# Altium project PCB_Project_RGB_Team--B2.PrjPcb
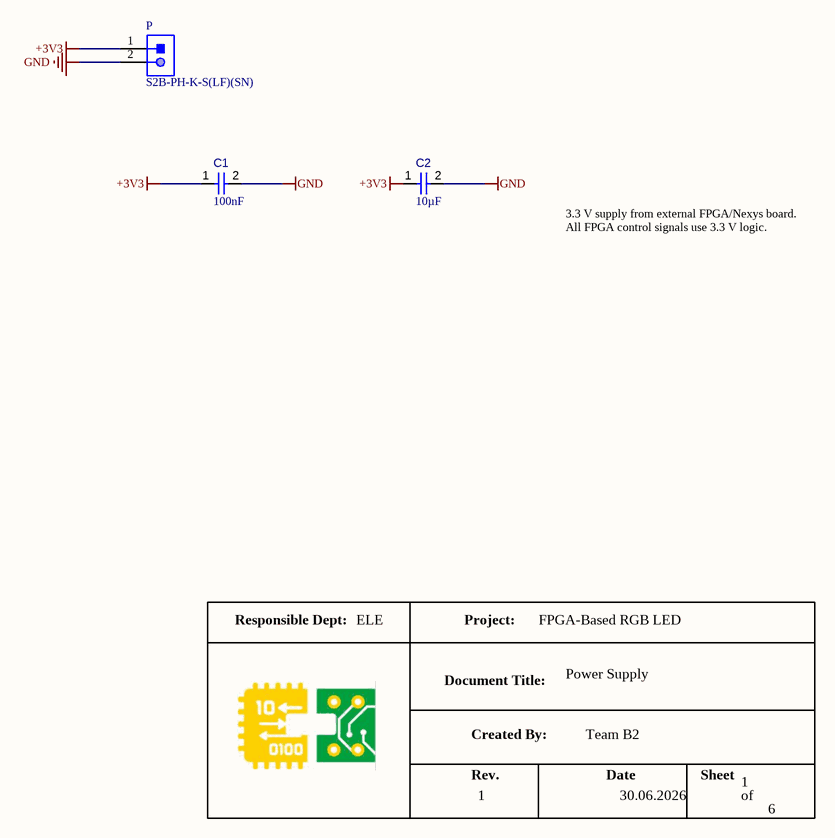
[diagram p0: 01_Power.SchDoc]
6 sheets, 35 parts. Net scope: global (net labels, ports and power ports of the same name join across sheets).
Board file: PCB.PcbDoc
Sheets:
  01_Power.SchDoc
  02_FPGA_Interface.SchDoc
  03_Mode_Inputs.SchDoc
  04_RGB_LED_Driver.SchDoc
  05_Testpoints_Output.SchDoc
  06_Clock_Configuration.SchDoc

## Sheet 01_Power.SchDoc
size A; SheetNumber: 1; SheetTotal: 6

### Parts
C1  value 100nF  [CAPC2013X95X50LL10T25]  (hidden comment: Capacitor 100 nF +/-10% 50 V 0805)
C2  value 10µF  [CAPC0805(2012)145_L]  (hidden comment: Capacitor 10µF +/-20% 25V 0805)
P  S2B-PH-K-S(LF)(SN)  [JST-S2B-PH-K-S_V]

### Nets
+3V3: C1.1 C2.1 P.1  [project net  +3V3]
GND: C1.2 C2.2 P.2

### Notes on the sheet
- 3.3 V supply from external FPGA/Nexys board.
  All FPGA control signals use 3.3 V logic.
- Responsible Dept:
- ELE
- Project:
- FPGA-Based RGB LED
- Document Title:
- Created By:
- Power Supply
- Team B2
- Rev.
- 1
- Date
- 30.06.2026
- Sheet
- of
- 6

### Library data of the parts
C1 = CMP-001-00018-6: Chip Capacitor, 100 nF, +/- 10%, 50 V, 0805 (2012 Metric); Capacitor Type: Ceramic; Voltage Rating: 50V; Pins: 2; Max Operating Temperature: 125°C; Min Operating Temperature: -55°C; Mounting Technology: SM; Case/Package: 0805; RoHS Compliant: True; Tolerance: 10%
C2 = CMP-001-00079-4: Chip Capacitor, 10µF +/-20%, 25V, 0805, Thickness 1.45 mm; Tolerance: 10%; Max Operating Temperature: 85°C; Case/Package: 0805; Voltage Rating: 25V; Min Operating Temperature: -55°C; Mounting Technology: SMT; Pins: 2
P = CMP-1755-00004-1: Male Header, Pitch 2 mm, 1 x 2 Position, Height 4.8 mm, Tail Length 3.4 mm, -25 to 85 degC, RoHS, Bulk; Case\Package: Radial; Tolerance: 20%; Capacitance: 10 uF; Voltage Rating (DC): 50 V; Packaging: Bulk; ComponentLink1URL: http://www.jst-mfg.com/product/pdf/eng/ePH.pdf; Radiation Hardening: No; Height: 11 mm; Package Quantity: 200; PackageDescription: Male Header, Pitch 2 mm, 1 x 2 Position, Height 4.8 mm, Tail Length 3.4 mm; PackageReference: S2B-PH-K-S; Diameter: 5 mm; Pins: 2; Mount: Through Hole; Max Operating Temperature: 85 degC; Min Operating Temperature: -40 degC; ComponentLink1Description: Datasheet; DatasheetVersion: Dec-12; Length: 11 mm; Lead Pitch: 2 mm; REACH SVHC: No SVHC; Voltage Rating: 50 V; RoHSCompliant: true

## Sheet 02_FPGA_Interface.SchDoc
size A; SheetNumber: 2; SheetTotal: 6
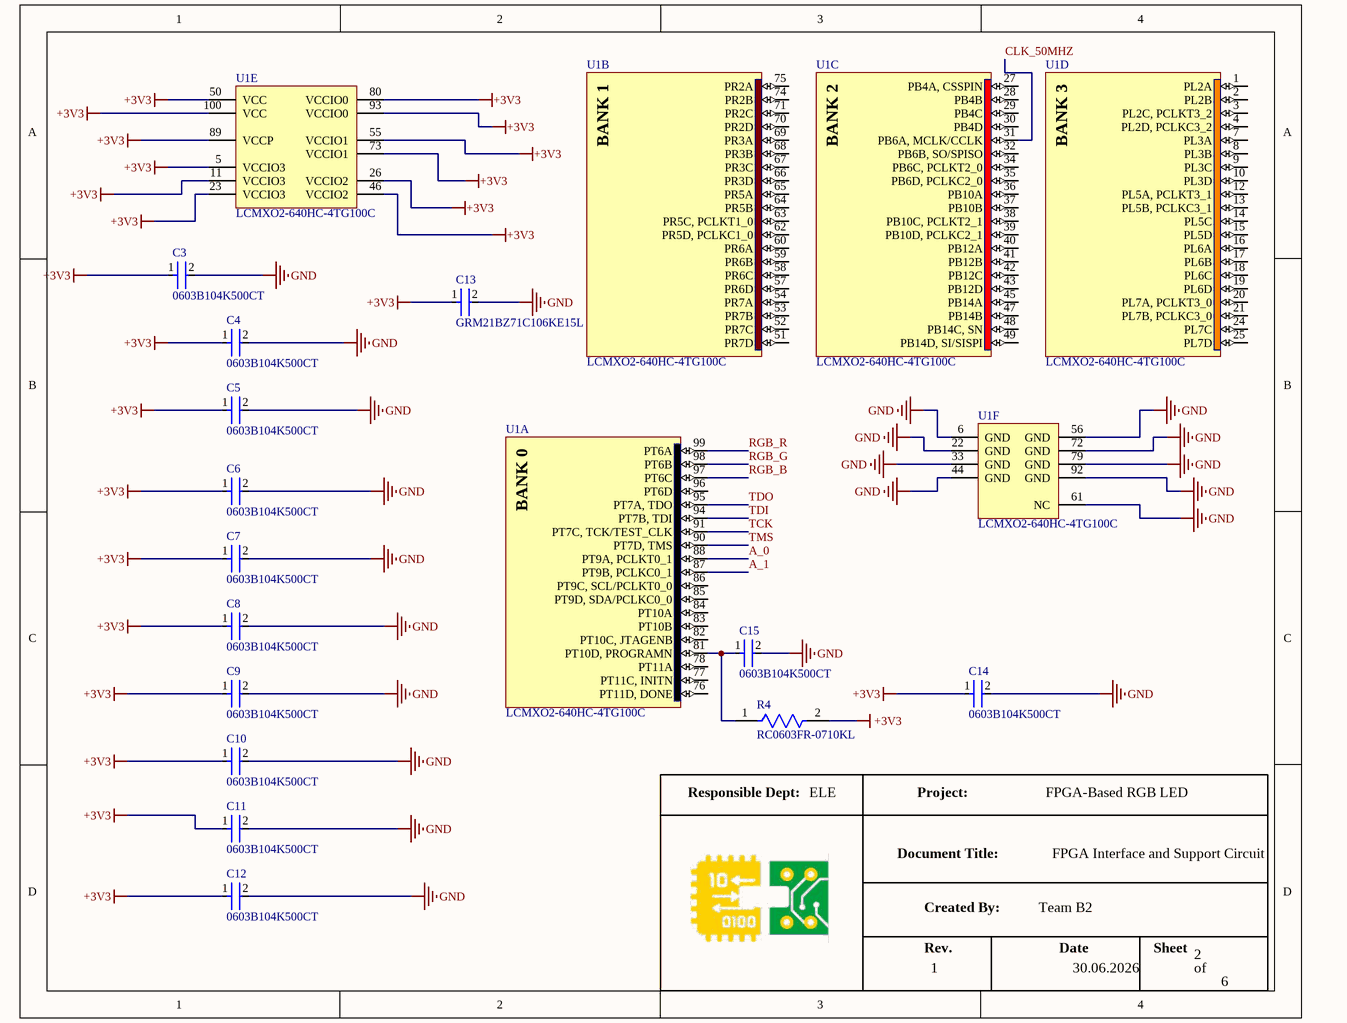
[diagram p1: 02_FPGA_Interface.SchDoc]

### Parts
C3  0603B104K500CT  [FP-0603B104K500CT-IPC_C]
C4  0603B104K500CT  [FP-0603B104K500CT-IPC_C]
C5  0603B104K500CT  [FP-0603B104K500CT-IPC_C]
C6  0603B104K500CT  [FP-0603B104K500CT-IPC_C]
C7  0603B104K500CT  [FP-0603B104K500CT-IPC_C]
C8  0603B104K500CT  [FP-0603B104K500CT-IPC_C]
C9  0603B104K500CT  [FP-0603B104K500CT-IPC_C]
C10  0603B104K500CT  [FP-0603B104K500CT-IPC_C]
C11  0603B104K500CT  [FP-0603B104K500CT-IPC_C]
C12  0603B104K500CT  [FP-0603B104K500CT-IPC_C]
C13  GRM21BZ71C106KE15L  [FP-GRM21B-0_2-e0_2_0_7-IPC_C]
C14  0603B104K500CT  [FP-0603B104K500CT-IPC_C]
C15  0603B104K500CT  [FP-0603B104K500CT-IPC_C]
R4  RC0603FR-0710KL  [FP-RC0603-0_55-IPC_C]
U1  LCMXO2-640HC-4TG100C  [TQFP100_M]  (parts A,B,C,D,E,F of 6)

### Nets
 +3V3: C3.1 C4.1 C5.1 C6.1 C7.1 C8.1 C9.1 C10.1 C11.1 C12.1 C13.1 C14.1 R4.2 U1.5(VCCIO3) U1.11(VCCIO3) U1.23(VCCIO3) U1.26(VCCIO2) U1.46(VCCIO2) U1.50(VCC) U1.55(VCCIO1) U1.73(VCCIO1) U1.80(VCCIO0) U1.89(VCCP) U1.93(VCCIO0) U1.100(VCC)  [also labelled +3V3]
GND: C3.2 C4.2 C5.2 C6.2 C7.2 C8.2 C9.2 C10.2 C11.2 C12.2 C13.2 C14.2 C15.2 U1.6(GND) U1.22(GND) U1.33(GND) U1.44(GND) U1.56(GND) U1.61(NC) U1.72(GND) U1.79(GND) U1.92(GND)
A_0: U1.88(PT9A,_PCLKT0_1)
A_1: U1.87(PT9B,_PCLKC0_1)
CLK_50MHZ: U1.31(PB6A,_MCLK/CCLK)
RGB_B: U1.97(PT6C)
RGB_G: U1.98(PT6B)
RGB_R: U1.99(PT6A)
TCK: U1.91(PT7C,_TCK/TEST_CLK)
TDI: U1.94(PT7B,_TDI)
TDO: U1.95(PT7A,_TDO)
TMS: U1.90(PT7D,_TMS)
NetC15_1: C15.1 R4.1 U1.81(PT10D,_PROGRAMN)

Not connected (* = marked no-connect by the designer): U1 1(PL2A) 2(PL2B) 3(PL2C,_PCLKT3_2) 4(PL2D,_PCLKC3_2) 7(PL3A) 8(PL3B) 9(PL3C) 10(PL3D) 12(PL5A,_PCLKT3_1) 13(PL5B,_PCLKC3_1) 14(PL5C) 15(PL5D) 16(PL6A) 17(PL6B) 18(PL6C) 19(PL6D) 20(PL7A,_PCLKT3_0) 21(PL7B,_PCLKC3_0) 24(PL7C) 25(PL7D) 27(PB4A,_CSSPIN) 28(PB4B) 29(PB4C) 30(PB4D) 32(PB6B,_SO/SPISO) 34(PB6C,_PCLKT2_0) 35(PB6D,_PCLKC2_0) 36(PB10A) 37(PB10B) 38(PB10C,_PCLKT2_1) 39(PB10D,_PCLKC2_1) 40(PB12A) 41(PB12B) 42(PB12C) 43(PB12D) 45(PB14A) 47(PB14B) 48(PB14C,_SN) 49(PB14D,_SI/SISPI) 51(PR7D) 52(PR7C) 53(PR7B) 54(PR7A) 57(PR6D) 58(PR6C) 59(PR6B) 60(PR6A) 62(PR5D,_PCLKC1_0) 63(PR5C,_PCLKT1_0) 64(PR5B) 65(PR5A) 66(PR3D) 67(PR3C) 68(PR3B) 69(PR3A) 70(PR2D) 71(PR2C) 74(PR2B) 75(PR2A) 76(PT11D,_DONE) 77(PT11C,_INITN) 78(PT11A) 82(PT10C,_JTAGENB) 83(PT10B) 84(PT10A) 85(PT9D,_SDA/PCLKC0_0) 86(PT9C,_SCL/PCLKT0_0) 96(PT6D)

### Notes on the sheet
- Responsible Dept:
- ELE
- Project:
- FPGA-Based RGB LED
- Document Title:
- Created By:
- Team B2
- FPGA Interface and Support Circuit
- Rev.
- 1
- Date
- 30.06.2026
- Sheet
- of
- 2
- 6
- (in symbol CMP-0111-00271-1, part A) BANK 0
- (in symbol CMP-0111-00271-1, part B) BANK 1
- (in symbol CMP-0111-00271-1, part C) BANK 2
- (in symbol CMP-0111-00271-1, part D) BANK 3

### Library data of the parts
C3-C12 C14 C15 = CMP-45632-000007-1: CAP CER 0.1UF 50V X7R 0603; Tolerance: 10%; Capacitance: 100nF; Radiation Hardening: No; Depth: 0.8mm; Length: 1.6mm; Voltage Rating: 50V; Dielectric: X7R; Case/Package: 0603; RoHS Compliant: Yes; Case Code (Metric): 1608; Voltage Rating (DC): 50V; Min Operating Temperature: -55°C; Series: -; Max Operating Temperature: 125°C; Lead Free: Lead Free; Case Code (Imperial): 0603; Packaging: Tape and Reel
C13 = CMP-06035-007712-1: Chip Multilayer Ceramic Capacitors for General Purpose, 0805, 10uF, X7R, 15%, 10%, 16V
R4 = CMP-2100-03664-2: RES 10K OHM 1% 1/10W 0603; Voltage Rating: 75V; Voltage Rating (DC): 50V; Resistance: 10kR; Power Rating: 100mW; Temperature Coefficient: 100ppm/°C; Depth: 0.8mm; Termination: SMD/SMT; Resistor Type: Thick Film; Series: RC; Construction: Rectangular; Features: Moisture Resistant; Packaging: Tape and Reel; Min Operating Temperature: -55°C; Number of Terminations: 2; Lead Pitch: 0.3mm; RoHS Compliant: Yes; Case/Package: 0603; Resistance Tolerance: 1%; Military Standard: Not; Weight: 7.1E-05oz; Number of Pins: 2; Tolerance: 1%; Length: 1.6mm; Case Code (Imperial): 0603; Lead Free: Lead Free; Width: 0.8mm; Max Power Dissipation: 100mW; Height: 0.45mm; Max Operating Temperature: 155°C; Case Code (Metric): 1608; Size Code: 0603
U1 = CMP-0111-00271-1: MachXO2 High Performance CPLD with 640 LUTs, Voltage Regulator, 2.5V/3.3V, 100-pin TQFP, Speed Grade-4, Commercial Grade, Halogen Free (RoHS); PackageDescription: 100-Pin Thin Quad Flat Pack (TQFP100); PackageVersion: ver02.6, Nov-2010; PackageReference: TQFP100; Code_JEDEC: MS-026-BED; DatasheetVersion: ver01.0, Nov-2010

## Sheet 03_Mode_Inputs.SchDoc
size A; SheetNumber: 3; SheetTotal: 6
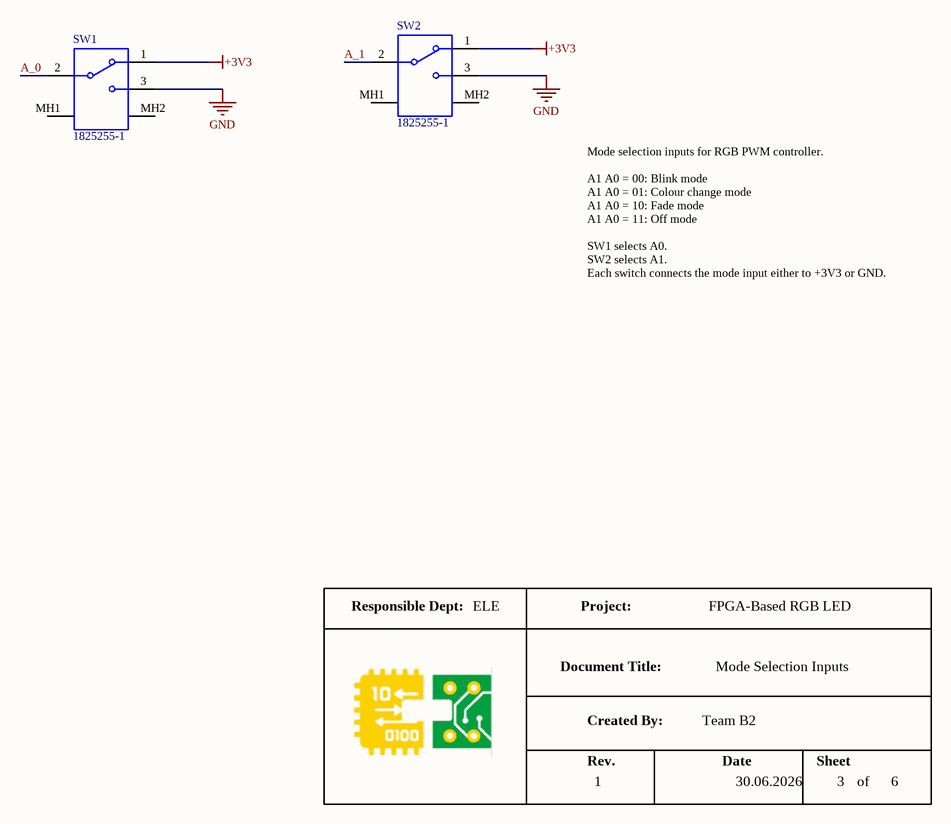
[diagram p2: 03_Mode_Inputs.SchDoc]

### Parts
SW1  1825255-1  [TECO-1825255-1_V]
SW2  1825255-1  [TECO-1825255-1_V]

### Nets
+3V3: SW1.1 SW2.1  [project net  +3V3]
GND: SW1.3 SW2.3
A_0: SW1.2
A_1: SW2.2

Not connected (* = marked no-connect by the designer): SW1 MH1 MH2; SW2 MH1 MH2

### Notes on the sheet
- Mode selection inputs for RGB PWM controller.
  A1 A0 = 00: Blink mode
  A1 A0 = 01: Colour change mode
  A1 A0 = 10: Fade mode
  A1 A0 = 11: Off mode
  SW1 selects A0.
  SW2 selects A1.
  Each switch connects the mode input either to +3V3 or GND.
- Responsible Dept:
- ELE
- Project:
- FPGA-Based RGB LED
- Document Title:
- Created By:
- Team B2
- Mode Selection Inputs
- Rev.
- 1
- Date
- 30.06.2026
- Sheet
- 3
- of
- 6

### Library data of the parts
SW1 SW2 = CMP-011-00001-2: Slide Switch, SPDT, 0.3A, 125 V, -20 to 85 degC, 5-Pin THD, RoHS, Tray; Manufacturer: TE Connectivity; Current Rating: 300mA; Voltage Rating (AC): 125V; Max Contact Resistance: 30mohm; Operating Force: 600gf; Manufacturer URL: http://www.te.com/; Max Current Rating: 300mA; Contact Plating: Silver; Contact Material: Copper; Datasheet URL: http://www.te.com/commerce/DocumentDelivery/DDEController?Action=showdoc&DocId=Customer+Drawing%7F1825255%7FA4%7Fpdf%7FEnglish%7FENG_CD_1825255_A4_baseFilename.pdf%7F1825255-1; Throw Configuration: SPDT; Packaging: Bulk; Package Quantity: 560; Max Voltage Rating (AC): 125V; Mounting Technology: TH; RoHS Compliant: True; Case/Package: 1825255-1; Datasheet Version: Rev. A4, 03/2014; Contact Finish: Silver; Package Reference: 1825255-1; Package Description: 5-Pin Through Hole Device, Body 6.7 x 16 mm, Pitch 4 mm; Min Operating Temperature: -20°C; Max Operating Temperature: 85°C

## Sheet 04_RGB_LED_Driver.SchDoc
size 431 x 279 mm; SheetNumber: 4; SheetTotal: 6
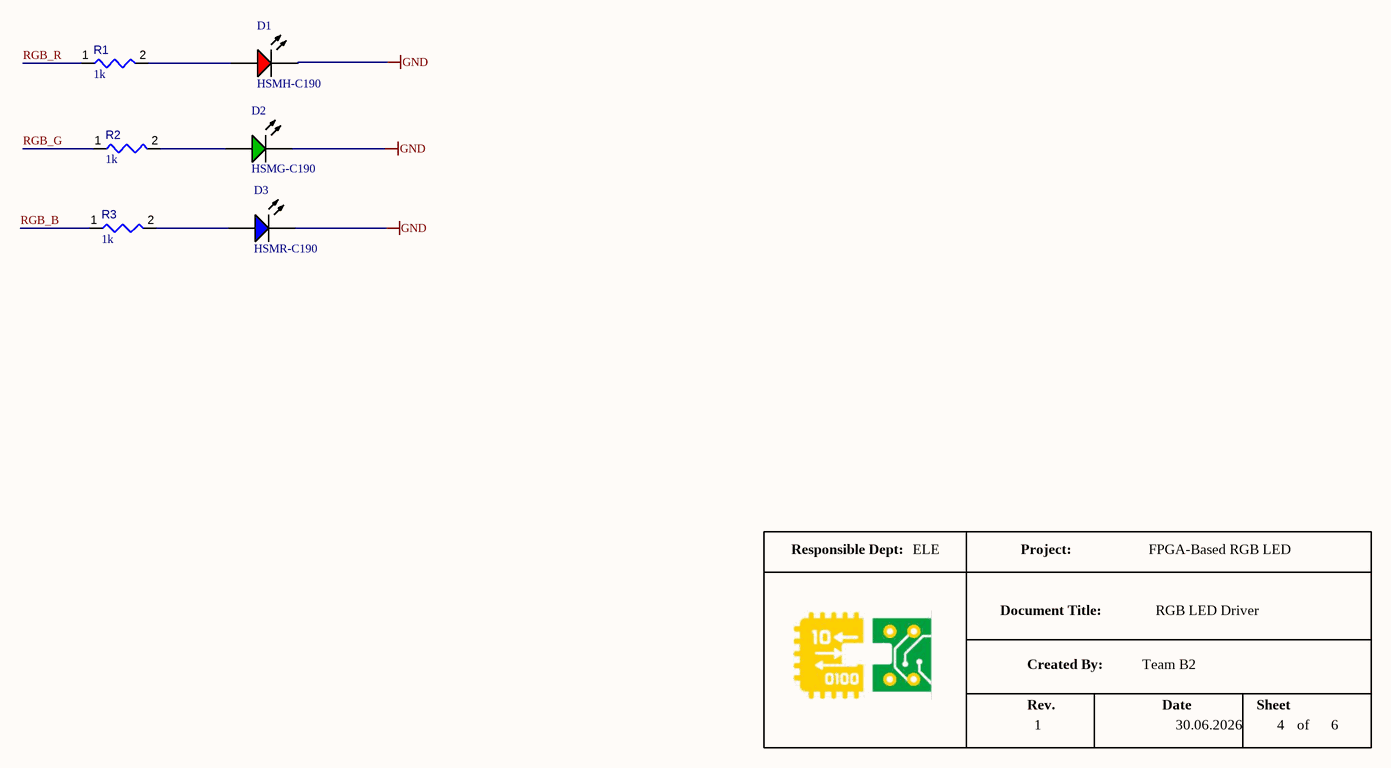
[diagram p3: 04_RGB_LED_Driver.SchDoc]

### Parts
D1  HSMH-C190  [AVAG-HSMX-C190_V]
D2  HSMG-C190  [AVAG-HSMX-C190_V]
D3  HSMR-C190  [AVAG-HSMX-C190_V]
R1  value 1k  [RESC0805(2012)_L]  (hidden comment: 1KR5J)
R2  value 1k  [RESC0805(2012)_L]  (hidden comment: 1KR5J)
R3  value 1k  [RESC0805(2012)_L]  (hidden comment: 1KR5J)

### Nets
GND: D1.2(K) D2.2(K) D3.2(K)
RGB_B: R3.1
RGB_G: R2.1
RGB_R: R1.1
NetD1_1: D1.1(A) R1.2
NetD2_1: D2.1(A) R2.2
NetD3_1: D3.1(A) R3.2

### Notes on the sheet
- Responsible Dept:
- ELE
- Project:
- FPGA-Based RGB LED
- Document Title:
- Created By:
- Team B2
- RGB LED Driver
- Rev.
- 1
- Date
- 30.06.2026
- Sheet
- 4
- of
- 6

### Library data of the parts
D1 = CMP-007-00014-2: LED Uni-Color Red, 65 mW, 20 mA, -40 to 85 degC, 2-Pin SMD, RoHS, Tape and Reel; Manufacturer: Avago; Nominal Vf: 1.8V; Luminous Intensity: 17mcd; Power: 78mW; Forward Current: 20mA; Lens Style: Diffused; Viewing Angle: 170degrees; Package Quantity: 4000; Colour: Red; Manufacturer URL: http://www.avagotech.com/; Min Operating Temperature: -40°C; Datasheet URL: http://docs.avagotech.com/docs/AV02-0551EN; RoHS Compliant: True; Forward Voltage: 1.8V; Pins: 2; Max Operating Temperature: 85°C; Packaging: TapeandReel; Package Reference: HSMX-C190; Datasheet Version: Mar-12; Package Description: 2-Pin Surface Mount Device, Body 1.6 x 0.8 mm, Height 0.9 mm; Case/Package: 0603; Mounting Technology: SM; Illumination Colour: Red
D2 = CMP-007-00013-2: LED Uni-Color Green, 52 mW, 20 mA, -40 to 85 degC, 2-Pin SMD, RoHS, Tape and Reel; Manufacturer: Avago; Forward Current: 20mA; Viewing Angle: 170degrees; Luminous Intensity: 15mcd; Lens Style: Diffused; Forward Voltage: 2.2V; Power: 52mW; Mounting Technology: SM; RoHS Compliant: True; Packaging: TapeandReel; Illumination Colour: Green; Datasheet URL: http://docs.avagotech.com/docs/AV02-0551EN; Min Operating Temperature: -40°C; Max Operating Temperature: 85°C; Pins: 2; Package Description: 2-Pin Surface Mount Device, Body 1.6 x 0.8 mm, Height 0.9 mm; Nominal Vf: 2.2V; Case/Package: 0603; Manufacturer URL: http://www.avagotech.com/; Datasheet Version: Mar-12; Colour: Green; Package Reference: HSMX-C190; Package Quantity: 4000
D3 = CMP-007-00015-2: LED Uni-Color Blue, 78 mW, 20 mA, -40 to 85 degC, 2-Pin SMD, RoHS, Tape and Reel; Manufacturer: Avago; Forward Voltage: 3.4V; Power: 78mW; Forward Current: 20mA; Luminous Intensity: 55mcd; Lens Style: Diffused; Viewing Angle: 155degrees; Pins: 2; Max Operating Temperature: 85°C; Colour: Blue; Datasheet Version: Apr-10; RoHS Compliant: True; Mounting Technology: SM; Min Operating Temperature: -40°C; Illumination Colour: Blue; Package Quantity: 4000; Datasheet URL: http://docs.avagotech.com/docs/AV02-0977EN; Package Reference: HSMX-C190; Packaging: TapeandReel; Nominal Vf: 3.4V; Case/Package: 0603; Package Description: 2-Pin Surface Mount Device, Body 1.6 x 0.8 mm, Height 0.9 mm; Manufacturer URL: http://www.avagotech.com/
R1-R3 = CMP-009-00076-2: 1K 0.125W 5% 0805 (2012 Metric)  SMD; Power: 125mW; Pins: 2; Mounting Technology: SMT; Tolerance: 5%; Case/Package: 0805

## Sheet 05_Testpoints_Output.SchDoc
size A; SheetNumber: 5; SheetTotal: 6
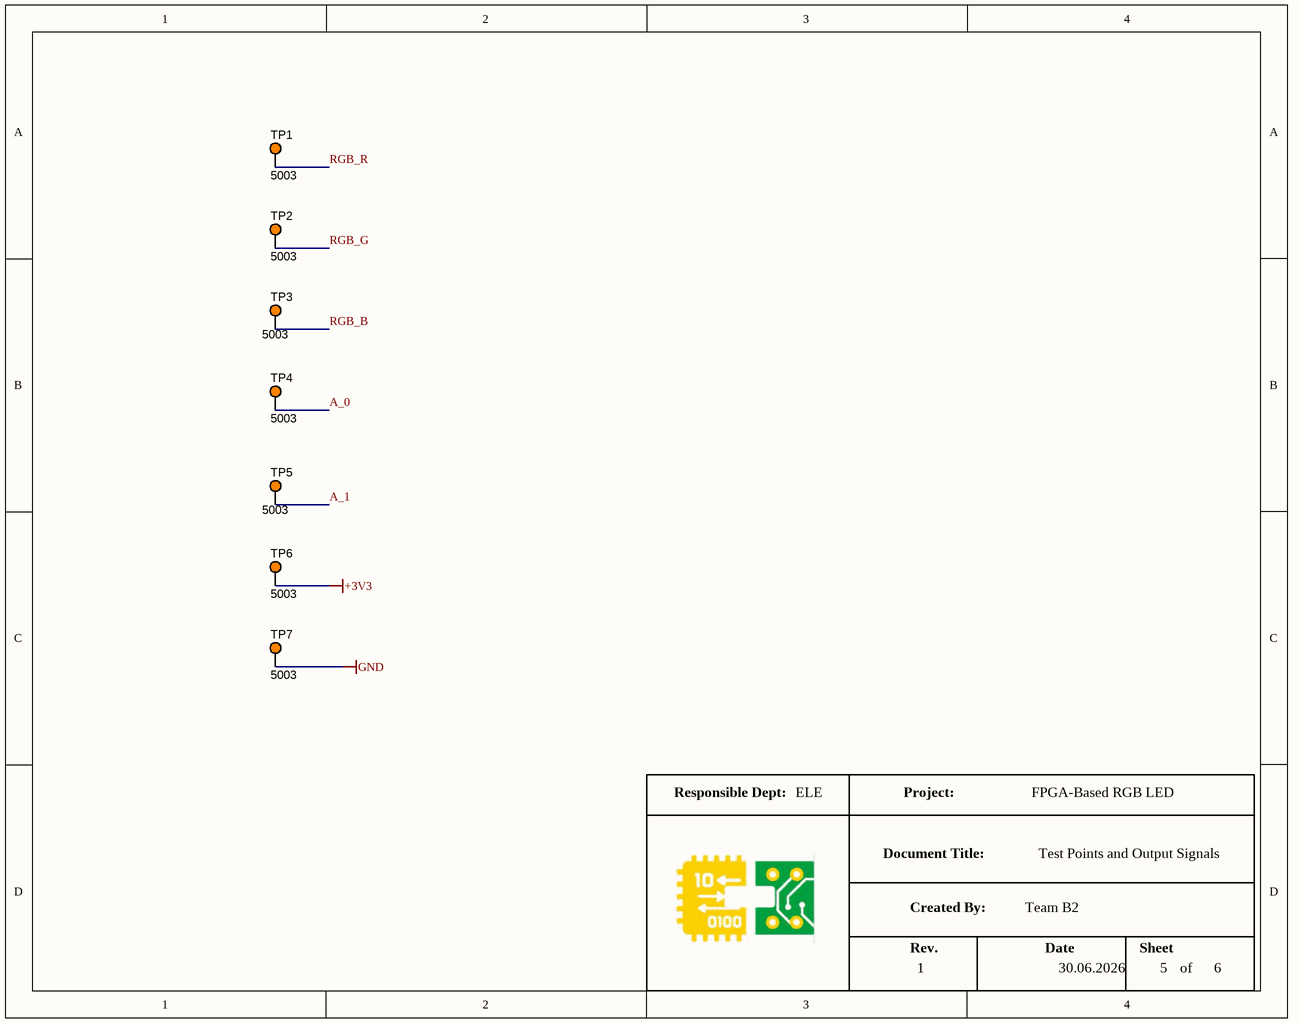
[diagram p4: 05_Testpoints_Output.SchDoc]

### Parts
TP1  5003  [KSTN-5003]
TP2  5003  [KSTN-5003]
TP3  5003  [KSTN-5003]
TP4  5003  [KSTN-5003]
TP5  5003  [KSTN-5003]
TP6  5003  [KSTN-5003]
TP7  5003  [KSTN-5003]

### Nets
+3V3: TP6.1  [project net  +3V3]
GND: TP7.1
A_0: TP4.1
A_1: TP5.1
RGB_B: TP3.1
RGB_G: TP2.1
RGB_R: TP1.1

### Notes on the sheet
- Responsible Dept:
- ELE
- Project:
- FPGA-Based RGB LED
- Document Title:
- Created By:
- Team B2
- Test Points and Output Signals
- Rev.
- 1
- Date
- 30.06.2026
- Sheet
- 5
- of
- 6

### Library data of the parts
TP1-TP7 = CMP-002-00037-2: Test Point, Orange, Height 4.6 mm, Tail Length 3 mm, 1-Pin THD, RoHS; Manufacturer: Keystone; Colour: Orange; Packaging: Bulk; Package Description: 1-Pin Through Hole Device, Dia 2.54 mm; Pins: 1; Package Reference: 5003; Datasheet Version: Jun-15; Case/Package: 5003; Mounting Technology: TH; Connector Type: TestPoint; Diameter: 2.54mm; Contact Material: Bronze; Datasheet URL: http://keyelco.com/userAssets/file/M65p56.pdf; Manufacturer URL: http://www.keyelco.com/; Package Quantity: 10; Contact Plating: Tin; RoHS Compliant: True

## Sheet 06_Clock_Configuration.SchDoc
size A; SheetNumber: 6; SheetTotal: 6
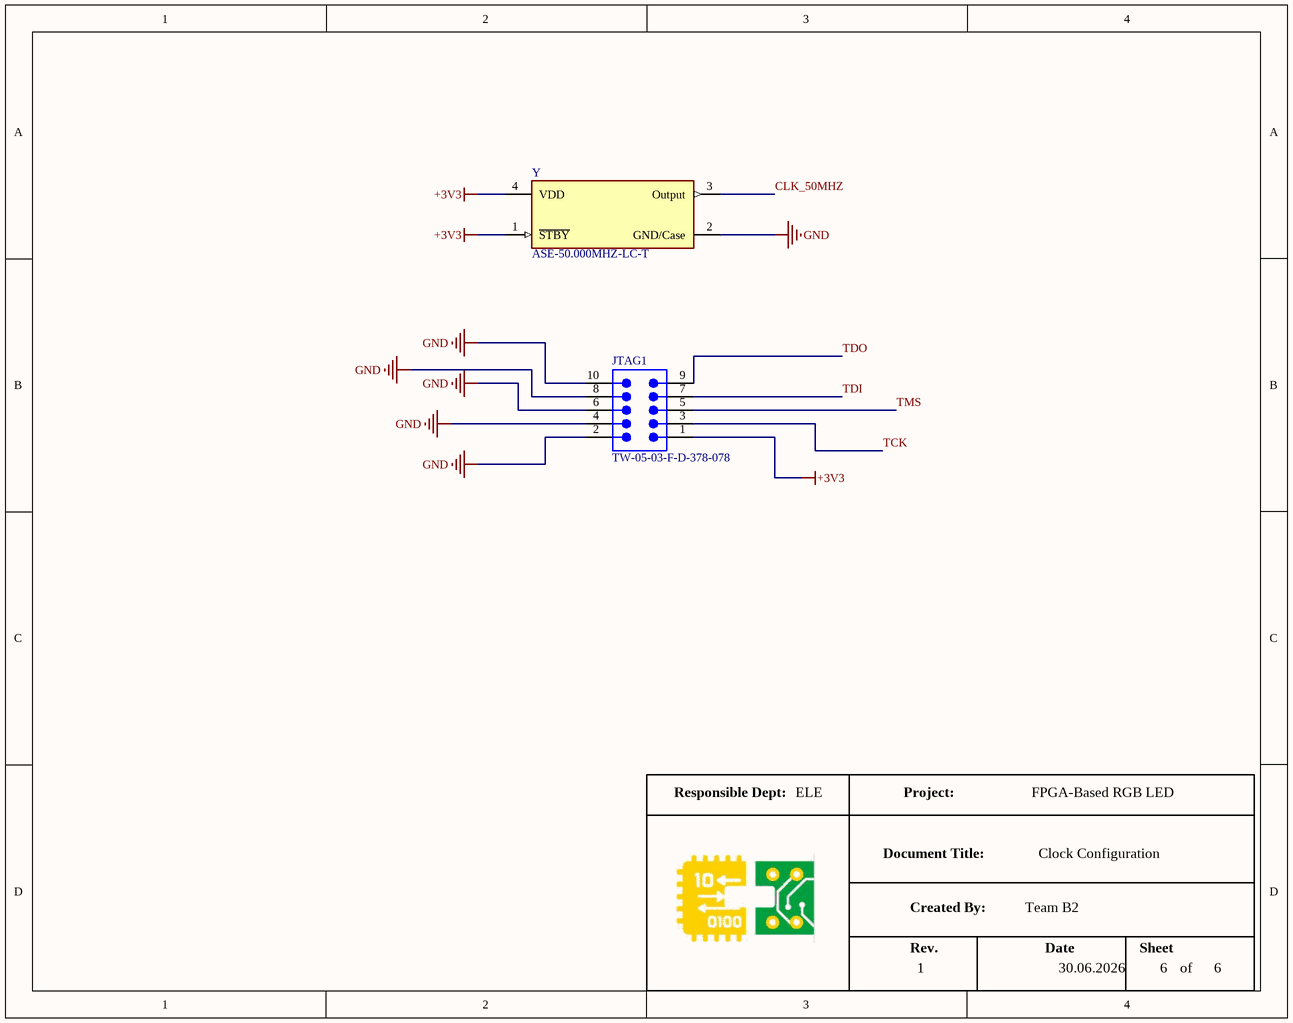
[diagram p5: 06_Clock_Configuration.SchDoc]

### Parts
JTAG1  TW-05-03-F-D-378-078  [SMTC-TW-05-03-X-D-378-078]
Y  ASE-50.000MHZ-LC-T  [FP-ASE-MFG]

### Nets
+3V3: JTAG1.1 Y.1(~{STBY}) Y.4(VDD)  [project net  +3V3]
GND: JTAG1.2 JTAG1.4 JTAG1.6 JTAG1.8 JTAG1.10 Y.2(GND/Case)
CLK_50MHZ: Y.3(Output)
TCK: JTAG1.3
TDI: JTAG1.7
TDO: JTAG1.9
TMS: JTAG1.5

### Notes on the sheet
- Responsible Dept:
- ELE
- Project:
- FPGA-Based RGB LED
- Document Title:
- Created By:
- Team B2
- Clock Configuration
- Rev.
- 1
- Date
- 30.06.2026
- Sheet
- 6
- of

### Library data of the parts
JTAG1 = CMP-1029-00381-1: Through-Hole Board Stacker, Vertical, -55 to 125 degC, 2 mm Pitch, 10-Pin, Male, RoHS; Manufacturer: Samtec; Pitch: 2 mm; ComponentLink3Description: Package Specification; Temperature Range: -55 to 125 degC; Mounting Technology: Through-hole; PackageReference: TW-05-03-X-D-378-078; ComponentLink3URL: http://www.samtec.com/documents/webfiles/cpdf/TW-XX-XX-X-X-XXX-XXX-XXX-XX-MKT2.pdf; PackageVersion: BF, 6/1998; PackageDescription: High Temp 2mm Terminal Strip(Board Stacking); PartNumber: TW-05-03-F-D-378-078; ComponentLink2Description: Datasheet; ComponentLink2URL: http://d2a072wq521u33.cloudfront.net/catalog_english//TW_TH.PDF; Orientation: Vertical; DatasheetVersion: F-214; RoHS: True; ComponentLink1URL: http://www.samtec.com; ComponentLink1Description: Manufacturer URL
Y = CMP-27762-009764-1: XTAL Oscillator 50MHz ±50ppm CMOS 3.3V 4-SMD 3.2mm x 2.5mm; Load Capacitance: 15pF; Max Supply Current: 19mA; Min Supply Voltage: 3.135V; Max Supply Voltage: 3.465V; Packaging: Tape and Reel; Height: 0.047inch; Mount: Surface Mount; Frequency Stability: 50ppm; Lead Free: Lead Free; Number of Pins: 4; Width: 0.098inch; Radiation Hardening: No; Max Operating Temperature: 85°C; Length: 3.2mm; REACH SVHC: No SVHC; Series: ASE; Depth: 2.5mm; Operating Supply Voltage: 3.3V; Min Operating Temperature: -40°C; Package Quantity: 1000; Operating Frequency: 50 MHz; Case/Package: SMD/SMT; Termination: SMD/SMT; Frequency: 50MHz

## Nets that join several sheets
 +3V3: 01_Power (C1.1 C2.1 P.1), 02_FPGA_Interface (25 pins), 03_Mode_Inputs (SW1.1 SW2.1), 05_Testpoints_Output (TP6.1), 06_Clock_Configuration (JTAG1.1 Y.1 Y.4)
GND: 01_Power (C1.2 C2.2 P.2), 02_FPGA_Interface (22 pins), 03_Mode_Inputs (SW1.3 SW2.3), 04_RGB_LED_Driver (D1.2 D2.2 D3.2), 05_Testpoints_Output (TP7.1), 06_Clock_Configuration (6 pins)
A_0: 02_FPGA_Interface (U1.88), 03_Mode_Inputs (SW1.2), 05_Testpoints_Output (TP4.1)
A_1: 02_FPGA_Interface (U1.87), 03_Mode_Inputs (SW2.2), 05_Testpoints_Output (TP5.1)
CLK_50MHZ: 02_FPGA_Interface (U1.31), 06_Clock_Configuration (Y.3)
RGB_B: 02_FPGA_Interface (U1.97), 04_RGB_LED_Driver (R3.1), 05_Testpoints_Output (TP3.1)
RGB_G: 02_FPGA_Interface (U1.98), 04_RGB_LED_Driver (R2.1), 05_Testpoints_Output (TP2.1)
RGB_R: 02_FPGA_Interface (U1.99), 04_RGB_LED_Driver (R1.1), 05_Testpoints_Output (TP1.1)
TCK: 02_FPGA_Interface (U1.91), 06_Clock_Configuration (JTAG1.3)
TDI: 02_FPGA_Interface (U1.94), 06_Clock_Configuration (JTAG1.7)
TDO: 02_FPGA_Interface (U1.95), 06_Clock_Configuration (JTAG1.9)
TMS: 02_FPGA_Interface (U1.90), 06_Clock_Configuration (JTAG1.5)